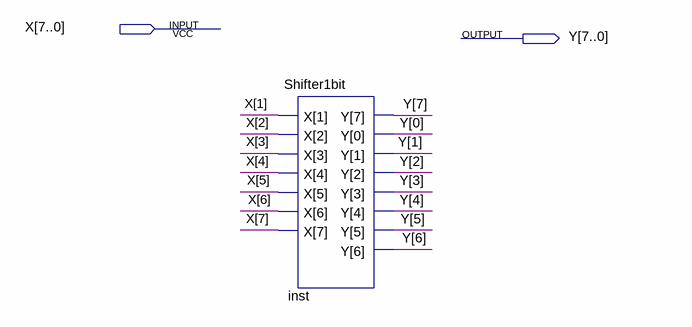
[diagram p0: schematic sheet]
// Quartus schematic SHIFT1.bdf as structural Verilog: 1 symbols, 2 pins
module SHIFT1 (
  input  [7:0] X,
  output [7:0] Y
);

  Shifter1bit inst (.X(X[7:1]), .Y(Y));
endmodule
